# EAGLE design Servotor32 (EAGLE 6.2)
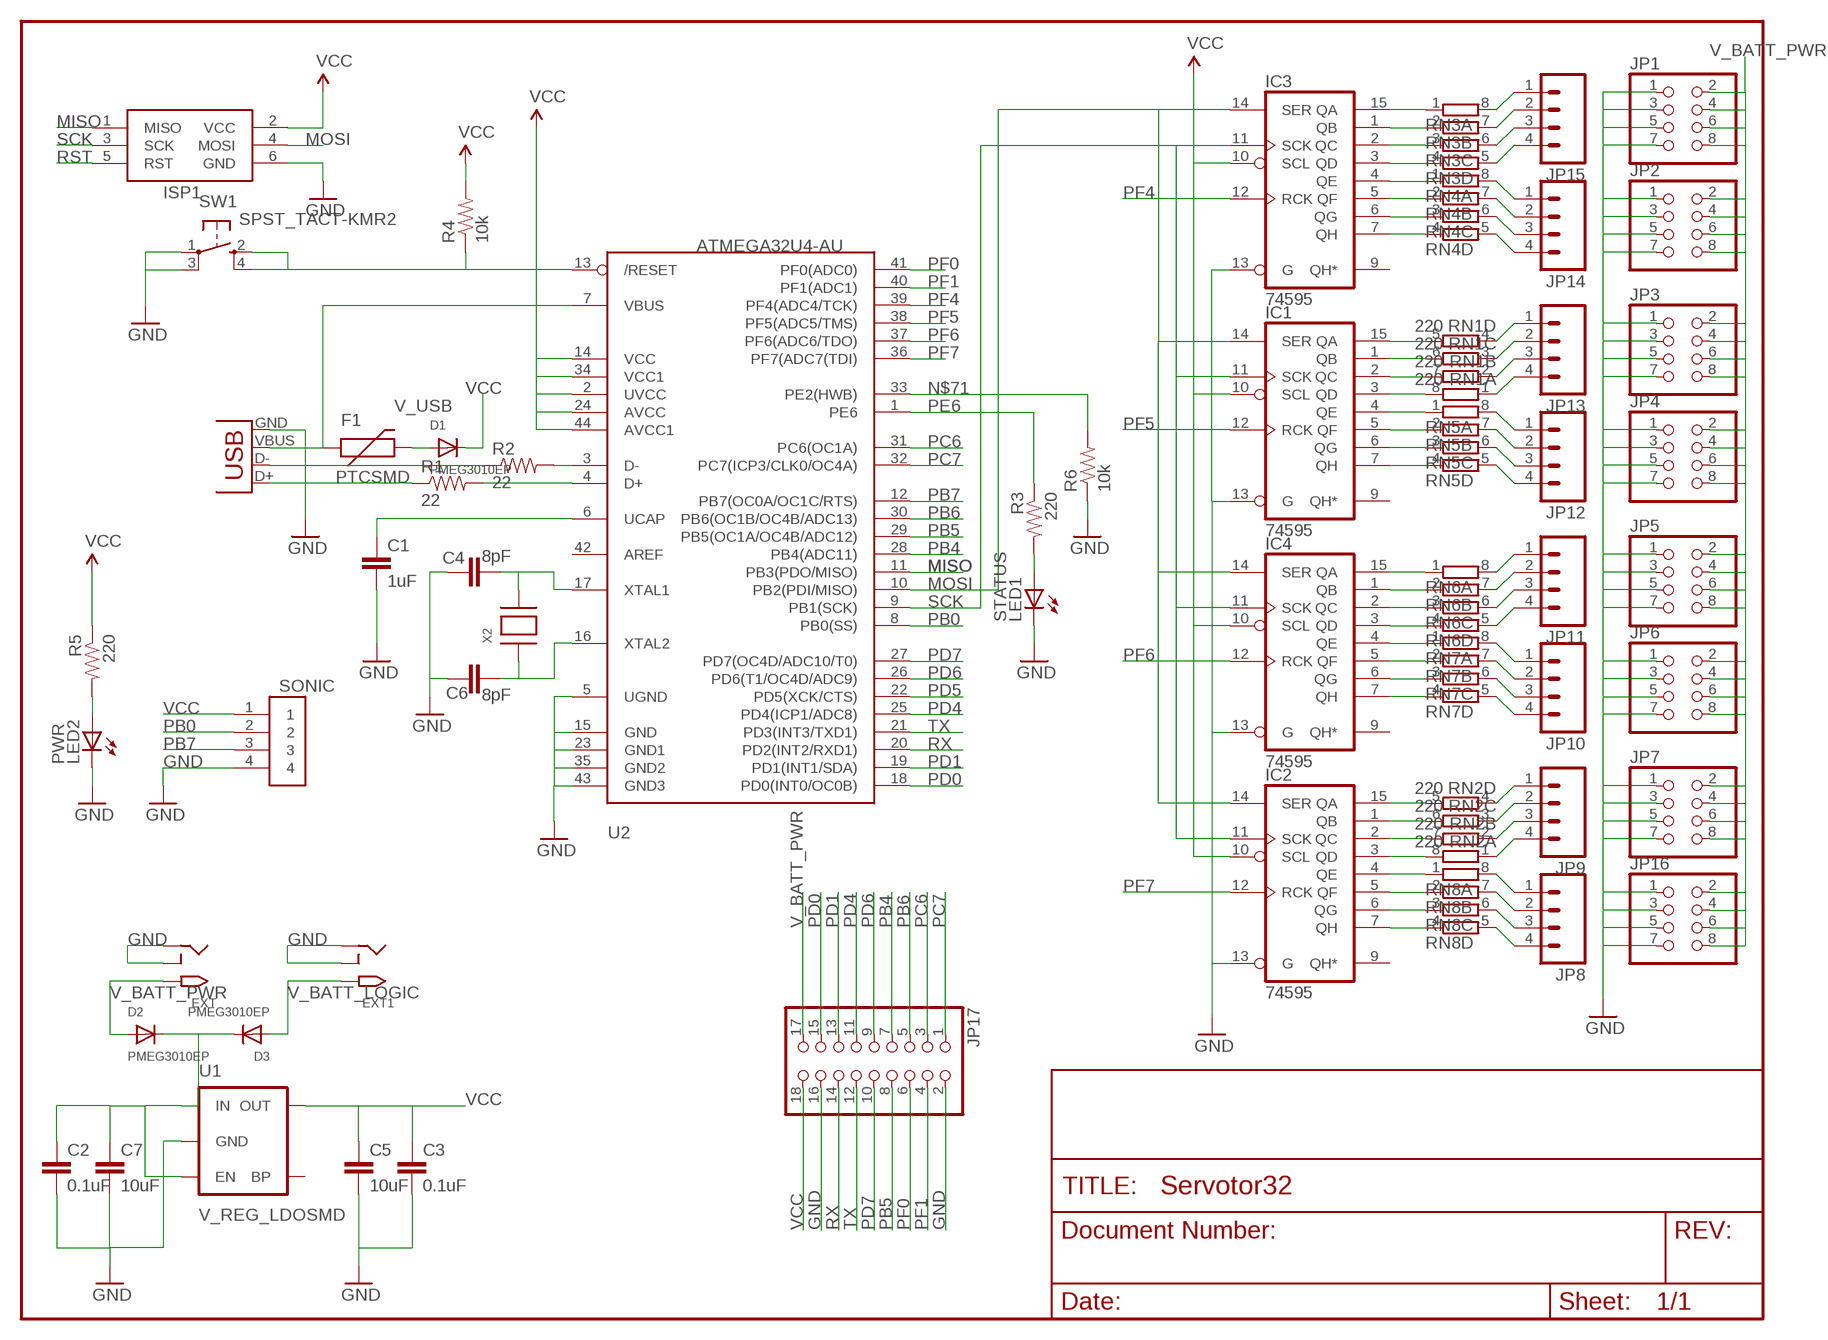
[diagram p0: schematic, sheet 1]

## Parts
C1  1uF  CAP0603-CAP  [0603-CAP]
C2  0.1uF  CAP0603-CAP  [0603-CAP]
C3  0.1uF  CAP0603-CAP  [0603-CAP]
C4  8pF  CAP0603-CAP  [0603-CAP]
C5  10uF  CAP0805  [0805]
C6  8pF  CAP0603-CAP  [0603-CAP]
C7  10uF  CAP0805  [0805]
D1  PMEG3010EP  [SOD-128]
D2  PMEG3010EP  [SOD-128]
D3  PMEG3010EP  [SOD-128]
EXT  2.1MMJACKTHM  [PJ-102A]
EXT1  2.1MMJACKTHM  [PJ-102A]
F1  PTCSMD  [PTC-1206]
IC1  74595  [TSSOP16]
IC2  74595  [TSSOP16]
IC3  74595  [TSSOP16]
IC4  74595  [TSSOP16]
ISP1  AVRISP-6  [AVRISP]
JP1  PINHD-2X4  [2X04]
JP2  PINHD-2X4  [2X04]
JP3  PINHD-2X4  [2X04]
JP4  PINHD-2X4  [2X04]
JP5  PINHD-2X4  [2X04]
JP6  PINHD-2X4  [2X04]
JP7  PINHD-2X4  [2X04]
JP8  M04PTH  [1X04]
JP9  M04PTH  [1X04]
JP10  M04PTH  [1X04]
JP11  M04PTH  [1X04]
JP12  M04PTH  [1X04]
JP13  M04PTH  [1X04]
JP14  M04PTH  [1X04]
JP15  M04PTH  [1X04]
JP16  PINHD-2X4  [2X04]
JP17  PINHD-2X9-BIG  [2X09-BIG]
LED1  STATUS  LEDSML0805  [SML0805]
LED2  PWR  LEDSML0805  [SML0805]
R1  22  RESISTOR0603-RES  [0603-RES]
R2  22  RESISTOR0603-RES  [0603-RES]
R3  220  RESISTOR0603-RES  [0603-RES]
R4  10k  RESISTOR0603-RES  [0603-RES]
R5  220  RESISTOR0603-RES  [0603-RES]
R6  10k  RESISTOR0603-RES  [0603-RES]
RN1  220  4R-NEXB38V  [EXB38V]
RN2  220  4R-NEXB38V  [EXB38V]
RN3  4R-NEXB38V  [EXB38V]
RN4  4R-NEXB38V  [EXB38V]
RN5  4R-NEXB38V  [EXB38V]
RN6  4R-NEXB38V  [EXB38V]
RN7  4R-NEXB38V  [EXB38V]
RN8  4R-NEXB38V  [EXB38V]
SONIC  SONIC  1X4-BIG  [1X04-BIG]
SW1  SPST_TACT-KMR2  [KMR2]
U1  V_REG_LDOSMD  [SOT23-5]
U2  ATMEGA32U4-AU  [TQFP44]
X1  USBSMD  [USB-MINIB]
X2  XTALNX5032  [NX5032]

## Nets
D+: R1.2 U2.4(D+)
D-: R2.2 U2.3(D-)
GND: C1.2 C2.2 C3.2 C4.2 C5.2 C6.2 C7.2 EXT1.RING EXT1.RING_SW EXT.RING EXT.RING_SW IC1.13(G) IC2.13(G) IC3.13(G) IC4.13(G) ISP1.6(GND) JP1.1 JP1.3 JP1.5 JP1.7 JP2.1 JP2.3 JP2.5 JP2.7 JP3.1 JP3.3 JP3.5 JP3.7 JP4.1 JP4.3 JP4.5 JP4.7 JP5.1 JP5.3 JP5.5 JP5.7 JP6.1 JP6.3 JP6.5 JP6.7 JP7.1 JP7.3 JP7.5 JP7.7 JP16.1 JP16.3 JP16.5 JP16.7 JP17.2 JP17.16 LED1.C LED2.C R6.1 SONIC.4 SW1.1(P) SW1.3(P1) U1.2(GND) U2.5(UGND) U2.15(GND) U2.23(GND1) U2.35(GND2) U2.43(GND3) X1.GND
MISO: ISP1.1(MISO) U2.11(PB3(PDO/MISO))
MOSI: IC1.14(SER) IC2.14(SER) IC3.14(SER) IC4.14(SER) ISP1.4(MOSI) U2.10(PB2(PDI/MISO))
N$1: IC3.15(QA) RN3.1
N$2: LED2.A R5.2
N$3: IC1.3(QD) RN1.8
N$4: R2.1 X1.D-
N$5: R1.1 X1.D+
N$6: IC2.3(QD) RN2.8
N$7: IC1.2(QC) RN1.7
N$8: IC2.2(QC) RN2.7
N$10: IC1.1(QB) RN1.6
N$11: IC3.1(QB) RN3.2
N$12: IC1.15(QA) RN1.5
N$13: IC3.2(QC) RN3.3
N$14: IC3.3(QD) RN3.4
N$15: IC2.1(QB) RN2.6
N$16: IC2.15(QA) RN2.5
N$17: IC3.4(QE) RN4.1
N$18: IC3.5(QF) RN4.2
N$19: IC3.6(QG) RN4.3
N$20: IC3.7(QH) RN4.4
N$21: IC1.4(QE) RN5.1
N$22: IC1.5(QF) RN5.2
N$23: JP13.1 RN1.4
N$24: IC1.6(QG) RN5.3
N$25: IC1.7(QH) RN5.4
N$26: JP12.1 RN5.8
N$27: JP13.2 RN1.3
N$28: JP13.3 RN1.2
N$29: JP13.4 RN1.1
N$30: JP12.2 RN5.7
N$31: JP12.3 RN5.6
N$32: JP12.4 RN5.5
N$33: JP15.1 RN3.8
N$34: JP15.2 RN3.7
N$35: JP15.3 RN3.6
N$36: JP15.4 RN3.5
N$37: JP14.1 RN4.8
N$38: JP14.2 RN4.7
N$39: JP14.3 RN4.6
N$40: JP14.4 RN4.5
N$41: JP9.4 RN2.1
N$42: JP9.3 RN2.2
N$43: JP9.2 RN2.3
N$44: JP9.1 RN2.4
N$45: IC2.4(QE) RN8.1
N$46: IC2.5(QF) RN8.2
N$47: IC2.6(QG) RN8.3
N$48: IC2.7(QH) RN8.4
N$49: JP8.1 RN8.8
N$50: JP8.2 RN8.7
N$51: JP8.3 RN8.6
N$52: JP8.4 RN8.5
N$54: IC4.1(QB) RN6.2
N$55: IC4.2(QC) RN6.3
N$56: IC4.3(QD) RN6.4
N$57: IC4.4(QE) RN7.1
N$58: IC4.5(QF) RN7.2
N$59: IC4.6(QG) RN7.3
N$60: IC4.7(QH) RN7.4
N$61: JP11.1 RN6.8
N$62: JP11.2 RN6.7
N$63: JP11.3 RN6.6
N$64: JP11.4 RN6.5
N$65: JP10.1 RN7.8
N$66: JP10.2 RN7.7
N$67: JP10.3 RN7.6
N$68: JP10.4 RN7.5
N$69: LED1.A R3.2
N$71: R6.2 U2.33(PE2(HWB))
N$73: IC4.15(QA) RN6.1
PB0: SONIC.2 U2.8(PB0(SS))
PB4: JP17.7 U2.28(PB4(ADC11))
PB5: JP17.8 U2.29(PB5(OC1A/OC4B/ADC12))
PB6: JP17.5 U2.30(PB6(OC1B/OC4B/ADC13))
PB7: SONIC.3 U2.12(PB7(OC0A/OC1C/RTS))
PC6: JP17.3 U2.31(PC6(OC1A))
PC7: JP17.1 U2.32(PC7(ICP3/CLK0/OC4A))
PD0: JP17.15 U2.18(PD0(INT0/OC0B))
PD1: JP17.13 U2.19(PD1(INT1/SDA))
PD4: JP17.11 U2.25(PD4(ICP1/ADC8))
PD5: U2.22(PD5(XCK/CTS))
PD6: JP17.9 U2.26(PD6(T1/OC4D/ADC9))
PD7: JP17.10 U2.27(PD7(OC4D/ADC10/T0))
PE6: R3.1 U2.1(PE6)
PF0: JP17.6 U2.41(PF0(ADC0))
PF1: JP17.4 U2.40(PF1(ADC1))
PF4: IC3.12(RCK) U2.39(PF4(ADC4/TCK))
PF5: IC1.12(RCK) U2.38(PF5(ADC5/TMS))
PF6: IC4.12(RCK) U2.37(PF6(ADC6/TDO))
PF7: IC2.12(RCK) U2.36(PF7(ADC7(TDI))
RST: ISP1.5(RST) R4.1 SW1.2(S) SW1.4(S1) U2.13(/RESET)
RX: JP17.14 U2.20(PD2(INT2/RXD1))
SCK: IC1.11(SCK) IC2.11(SCK) IC3.11(SCK) IC4.11(SCK) ISP1.3(SCK) U2.9(PB1(SCK))
TX: JP17.12 U2.21(PD3(INT3/TXD1))
UCAP: C1.1 U2.6(UCAP)
V_BATT: C2.1 C7.1 D2.P$1(C) D3.P$1(C) U1.1(IN) U1.3(EN)
V_BATT_LOGIC: D3.P$2(A) EXT1.TIP
V_BATT_PWR: D2.P$2(A) EXT.TIP JP1.2 JP1.4 JP1.6 JP1.8 JP2.2 JP2.4 JP2.6 JP2.8 JP3.2 JP3.4 JP3.6 JP3.8 JP4.2 JP4.4 JP4.6 JP4.8 JP5.2 JP5.4 JP5.6 JP5.8 JP6.2 JP6.4 JP6.6 JP6.8 JP7.2 JP7.4 JP7.6 JP7.8 JP16.2 JP16.4 JP16.6 JP16.8 JP17.17
V_USB: D1.P$2(A) F1.2
VBUS: F1.1 U2.7(VBUS) X1.VBUS
VCC: C3.1 C5.1 D1.P$1(C) IC1.10(SCL) IC2.10(SCL) IC3.10(SCL) IC4.10(SCL) ISP1.2(VCC) JP17.18 R4.2 R5.1 SONIC.1 U1.5(OUT) U2.2(UVCC) U2.14(VCC) U2.24(AVCC) U2.34(VCC1) U2.44(AVCC1)
XTAL1: C4.1 U2.17(XTAL1) X2.P$2
XTAL2: C6.1 U2.16(XTAL2) X2.P$1
Unconnected: IC1.9(QH*) IC2.9(QH*) IC3.9(QH*) IC4.9(QH*) U1.4(BP) U2.42(AREF)

## Power pins joined to a net without a drawn wire
GND: IC1.8(GND) IC2.8(GND) IC3.8(GND) IC4.8(GND)
VCC: IC1.16(VCC) IC2.16(VCC) IC3.16(VCC) IC4.16(VCC)

## Library data of the parts
C1-C7 = SparkFun-Passives:CAP: Capacitor Standard 0603 ceramic capacitor, and 0.1" leaded capacitor.
D1-D3 = arcbotics:PMEG3010EP
EXT EXT1 = adafruit:2.1MMJACK: 2.1mm x 5.5mm THM DC jack with internal switch. Digikey part #PJ-102A, 4UCON part #05537 2.1mm x 5.5mm SMT DC jack with internal switch. Digikey part #PJ-002A-SMT, 4UCON part #03267 By microbuilder.eu & adafruit.com
F1 = SparkFun:PTC: Resettable Fuse PTC Resettable Fuse. Spark Fun Electronics SKU : COM-08357
IC1-IC4 = arcbotics:74*595: 8-bit SHIFT REGISTER, output latch
ISP1 = adafruit:AVRISP: AVR ISP HEADER Standard 6 pin header for AVR programming
JP1-JP7 JP16 = pinhead-nosilk:PINHD-2X4: PIN HEADER
JP8-JP15 = pinhead-nosilk:M04: Header 4 Standard 4-pin 0.1" header. Use with straight break away headers (SKU : PRT-00116), right angle break away headers (PRT-00553), swiss pins (PRT-00743), machine pins (PRT-00117), and female headers (PRT-00115). Molex polarized connector foot print use with SKU : PRT-08231 with associated crimp pins and housings. 1MM SMD Version SKU: PRT-10208
JP17 = adafruit:PINHD-2X9: PIN HEADER With larger annulars
LED1 LED2 = led:LED: LED OSRAM: - CHIPLED LG R971, LG N971, LY N971, LG Q971, LY Q971, LO R971, LY R971 LH N974, LH R974 LS Q976, LO Q976, LY Q976 LO Q996 - Hyper CHIPLED LW Q18S LB Q993, LB Q99A, LB R99A - SideLED LS A670, LO A670, LY A670, LG A670, LP A670 LB A673, LV A673, LT A673, LW A673 LH A674 LY A675 LS A676, LA A676, LO A676, LY A676, LW A676 LS A679, LY A679, LG A679 - Hyper Micro SIDELED® LS Y876, LA Y876, LO Y876, LY Y876 LT Y87S - SmartLED LW L88C, LW L88S LB L89C, LB L89S, LG L890 LS L89K, LO L89K, LY L89K LS L896, LA L896, LO L896, LY L896 - TOPLED LS T670, LO T670, LY T670, LG T670, LP T670 LSG T670, LSP T670, LSY T670, LOP T670, LYG T670 LG T671, LOG T671, LSG T671 LB T673, LV T673, LT T673, LW T673 LH T674 LS T676, LA T676, LO T676, LY T676, LB T676, LH T676, LSB T676, LW T676 LB T67C, LV T67C, LT T67C, LS T67K, LO T67K, LY T67K, LW E67C LS E67B, LA E67B, LO E67B, LY E67B, LB E67C, LV E67C, LT E67C LW T67C LS T679, LY T679, LG T679 LS T770, LO T770, LY T770, LG T770, LP T770 LB T773, LV T773, LT T773, LW T773 LH T774 LS E675, LA E675, LY E675, LS T675 LS T776, LA T776, LO T776, LY T776, LB T776 LHGB T686 LT T68C, LB T68C - Hyper Mini TOPLED® LB M676 - Mini TOPLED Santana® LG M470 LS M47K, LO M47K, LY M47K Source: http://www.osram.convergy.de LUXEON: - LUMILED® LXK2-PW12-R00, LXK2-PW12-S00, LXK2-PW14-U00, LXK2-PW14-V00 LXK2-PM12-R00, LXK2-PM12-S00, LXK2-PM14-U00 LXK2-PE12-Q00, LXK2-PE12-R00, LXK2-PE12-S00, LXK2-PE14-T00, LXK2-PE14-U00 LXK2-PB12-K00, LXK2-PB12-L00, LXK2-PB12-M00, LXK2-PB14-N00, LXK2-PB14-P00, LXK2-PB14-Q00 LXK2-PR12-L00, LXK2-PR12-M00, LXK2-PR14-Q00, LXK2-PR14-R00 LXK2-PD12-Q00, LXK2-PD12-R00, LXK2-PD12-S00 LXK2-PH12-R00, LXK2-PH12-S00 LXK2-PL12-P00, LXK2-PL12-Q00, LXK2-PL12-R00 Source: www.luxeon.com KINGBRIGHT: KA-3528ASYC Source: www.kingbright.com
R1-R6 = SparkFun-Passives:RESISTOR: Resistor Basic schematic elements and footprints for 0603, 1206, and PTH resistors.
RN1-RN8 = resistor-dil:4R-N: Array Chip Resistor Source: RS Component / Phycomp; OC_FARNELL: unknown; OC_NEWARK: unknown
SONIC = adafruit:1X4: 4-pin connector
SW1 = adafruit:SPST_TACT: SMT 6mm switch, EVQQ2 series http://www.ladyada.net/library/eagle
U1 = SparkFun:V_REG_LDO: Voltage Regulator LDO Standard 150mA LDO voltage regulator in SOT-23 layout. Micrel part MIC5205. BP (by-pass) pin is used to lower output noise with 470pF cap.
U2 = adafruit:ATMEGA32U4: http://www.ladyada.net/library/eagle
X1 = SparkFun:USB: USB Connectors USB-B-PTH is fully proven SKU : PRT-00139 USB-miniB is fully proven SKU : PRT-00587 USB-A-PCB is untested. USB-A-H is throughly reviewed, but untested. Spark Fun Electronics SKU : PRT-00437 USB-B-SMT is throughly reviewed, but untested. Needs silkscreen touching up. USB-A-S has not been used/tested USB-MB-H has not been used/tested
X2 = adafruit:XTAL: Low cost SMT crystals, no capacitors included http://www.ladyada.net/library/eagle

## Board
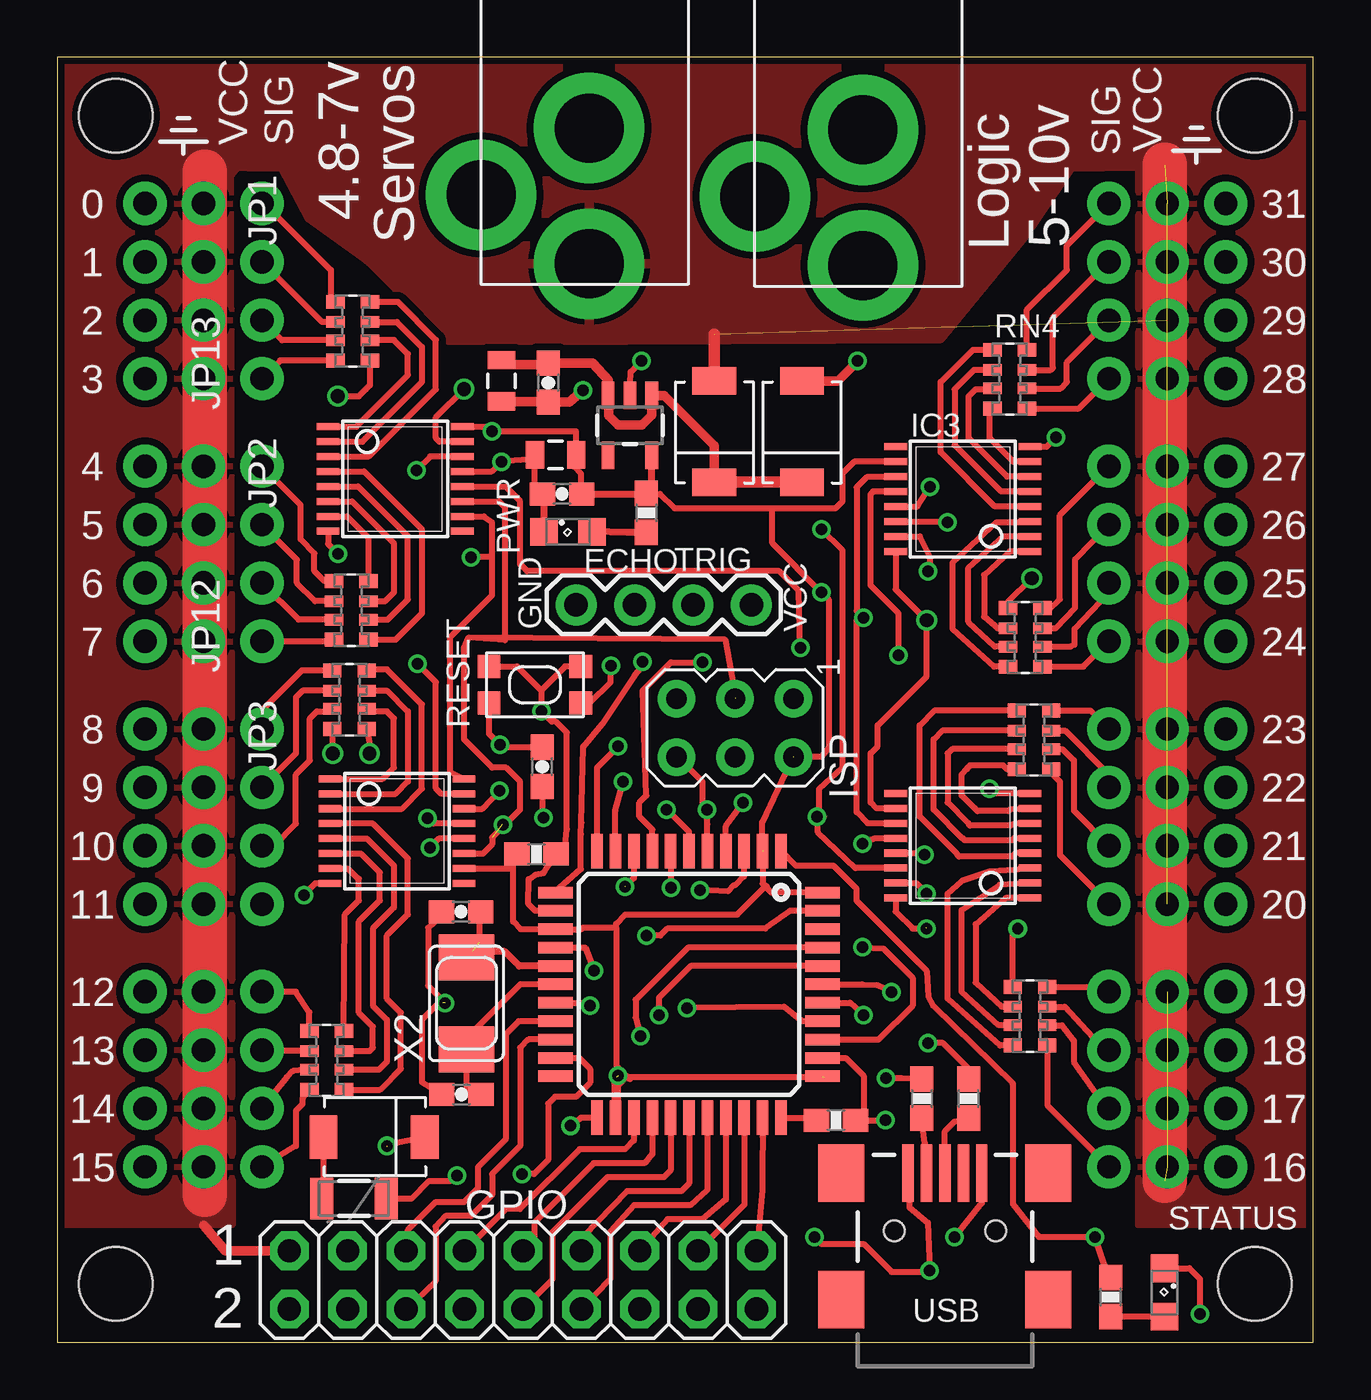
[diagram p1: board, top side]
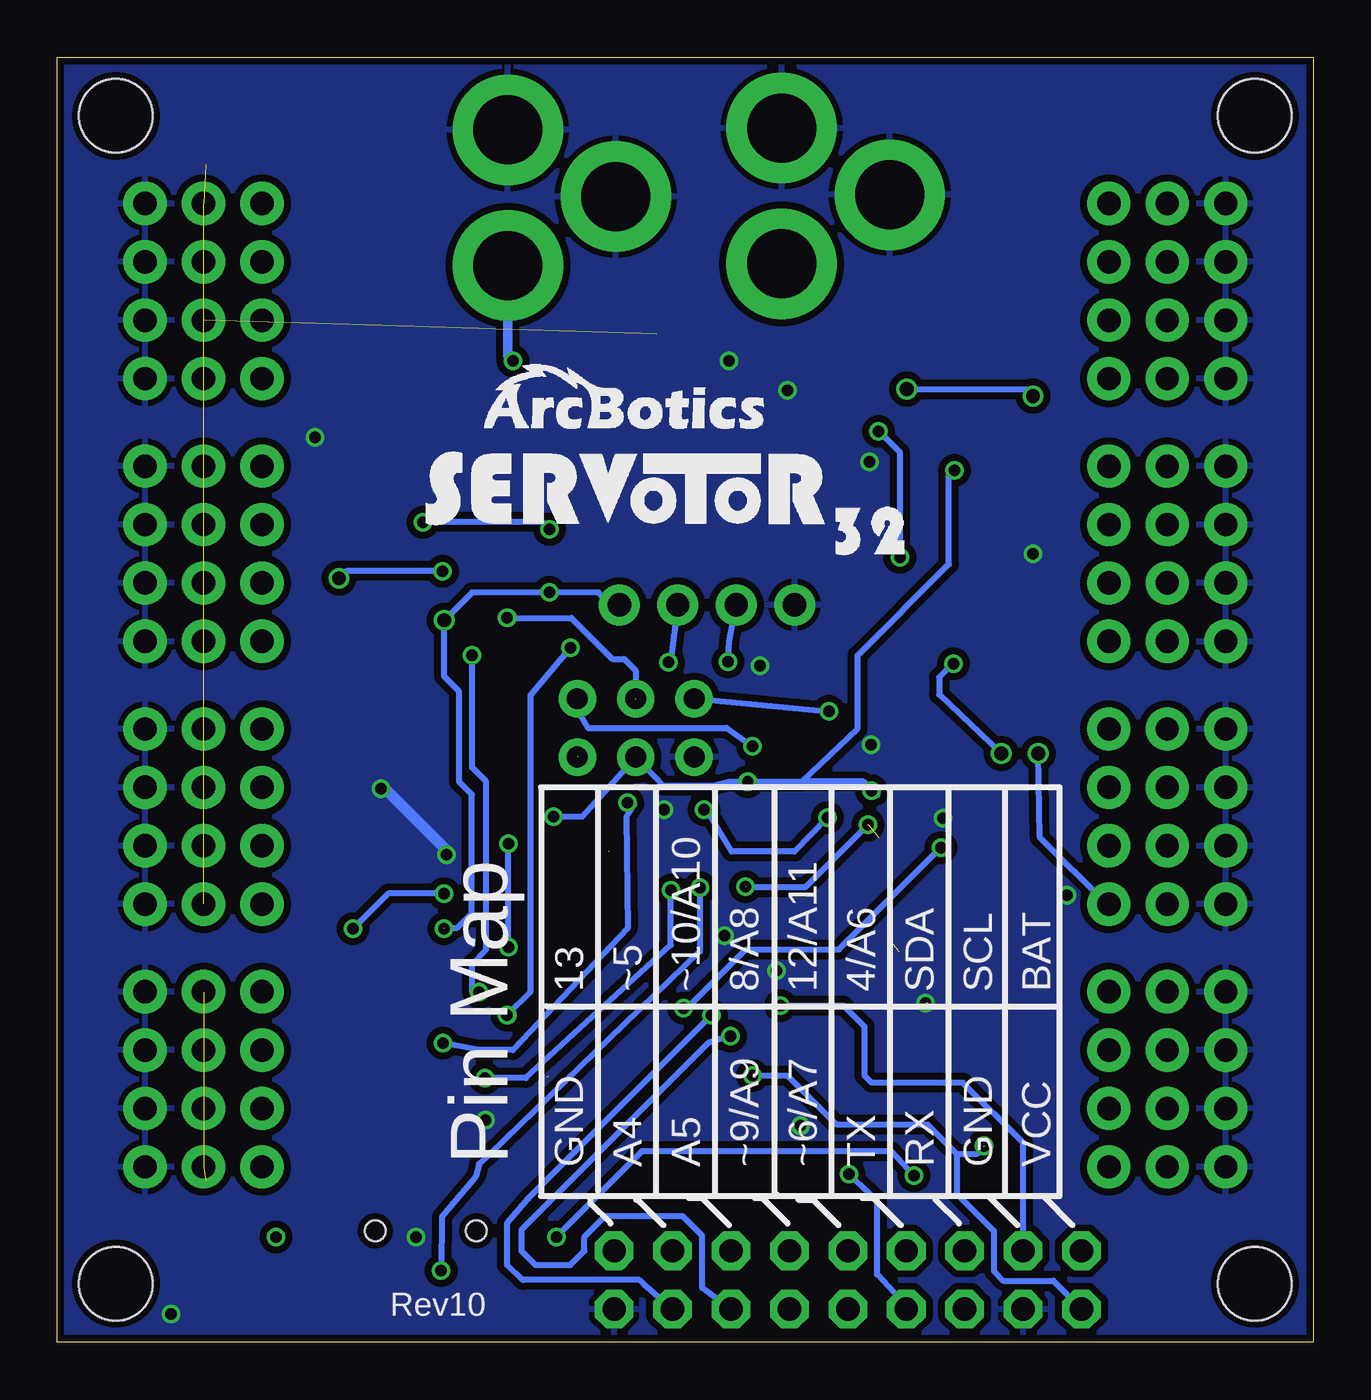
[diagram p2: board, bottom side, seen from below]

Size 54.61 x 55.88 mm. Coordinates in mm from the lower left corner, seen from the top.
Outline: 0,0 54.61,0 54.61,55.88 0,55.88 0,0
Copper layers (1*16): Top 0.035mm / dielectric 1.5mm / Bottom 0.035mm
Design rules: minimum track width 6mil, minimum drill 12mil, track to track 6mil, track to pad 6mil, pad to pad 6mil, via to via 6mil, smd to smd 0mil, copper to edge 10mil, drill to drill 10mil, minimum pad ring 10mil, minimum via ring 6mil, stop-mask expansion 2mil, vias tented up to drill 100mil, thermal gap 10mil
Holes 3.2 mm at 2.54,53.34 2.54,2.54 52.07,53.34 52.07,2.54

### Footprints (pad centres in the part's own frame; a part is rotated, then mirrored left to right if it is on the bottom)
0603-CAP = smd 1.1 x 1: 1 -0.85,0; 2 0.85,0
0805 = smd 0.8 x 1.2: 1 -0.9,0; 2 0.9,0
SOD-128 = smd 1.2 x 1.9: P$1 -2.223,0.016; P$2 2.179,0.016
PJ-102A = drill 3 pad 4.8: RING 0.1,-3.39; RING_SW -4.6,-6.29; TIP 0.1,-9.29
PTC-1206 = smd 1 x 1.8: 1 -1.4,0; 2 1.4,0
TSSOP16 = smd 0.305 x 0.991: 1 -2.275,-2.918; 2 -1.625,-2.918; 3 -0.975,-2.918; 4 -0.325,-2.918; 5 0.325,-2.918; 6 0.975,-2.918; 7 1.625,-2.918; 8 2.275,-2.918; 9 2.275,2.918; 10 1.625,2.918; 11 0.975,2.918; 12 0.325,2.918; 13 -0.325,2.918; 14 -0.975,2.918; 15 -1.625,2.918; 16 -2.275,2.918
AVRISP = drill 0.9 pad 1.626: 1 -1.27,2.54; 2 1.27,2.54; 3 -1.27,0; 4 1.27,0; 5 -1.27,-2.54; 6 1.27,-2.54
2X04 = drill 1.016 pad 1.88: 1 -3.81,-1.27; 2 -3.81,1.27; 3 -1.27,-1.27; 4 -1.27,1.27; 5 1.27,-1.27; 6 1.27,1.27; 7 3.81,-1.27; 8 3.81,1.27
1X04 = drill 1.016 pad 1.88: 1 0,0; 2 2.54,0; 3 5.08,0; 4 7.62,0
2X09-BIG = drill 1.016 pad 1.676 octagon: 1 -10.16,-1.27; 2 -10.16,1.27; 3 -7.62,-1.27; 4 -7.62,1.27; 5 -5.08,-1.27; 6 -5.08,1.27; 7 -2.54,-1.27; 8 -2.54,1.27; 9 0,-1.27; 10 0,1.27; 11 2.54,-1.27; 12 2.54,1.27; 13 5.08,-1.27; 14 5.08,1.27; 15 7.62,-1.27; 16 7.62,1.27; 17 10.16,-1.27; 18 10.16,1.27
SML0805 = smd 1.2 x 1.2: A 1.05,0; C -1.05,0
0603-RES = smd 1.1 x 1: 1 -0.85,0; 2 0.85,0
EXB38V = smd 0.6 x 0.8: 1 -1.275,-0.75; 4 1.275,-0.75; 5 1.275,0.75; 8 -1.275,0.75 | smd 0.5 x 0.8: 2 -0.4,-0.75; 3 0.4,-0.75; 6 0.4,0.75; 7 -0.4,0.75
1X04-BIG = drill 1.016 pad 1.778: 1 0,0; 2 2.54,0; 3 5.08,0; 4 7.62,0
KMR2 = smd 1 x 1: 1 2,0.8; 2 2,-0.8; 3 -2,0.8; 4 -2,-0.8
SOT23-5 = smd 0.55 x 1.2: 1 -0.95,-1.3; 2 0,-1.3; 3 0.95,-1.3; 4 0.95,1.3; 5 -0.95,1.3
TQFP44 = smd 1.5 x 0.5: 1 -5.8,4; 2 -5.8,3.2; 3 -5.8,2.4; 4 -5.8,1.6; 5 -5.8,0.8; 6 -5.8,0; 7 -5.8,-0.8; 8 -5.8,-1.6; 9 -5.8,-2.4; 10 -5.8,-3.2; 11 -5.8,-4; 23 5.8,-4; 24 5.8,-3.2; 25 5.8,-2.4; 26 5.8,-1.6; 27 5.8,-0.8; 28 5.8,0; 29 5.8,0.8; 30 5.8,1.6; 31 5.8,2.4; 32 5.8,3.2; 33 5.8,4 | smd 0.5 x 1.5: 12 -4,-5.8; 13 -3.2,-5.8; 14 -2.4,-5.8; 15 -1.6,-5.8; 16 -0.8,-5.8; 17 0,-5.8; 18 0.8,-5.8; 19 1.6,-5.8; 20 2.4,-5.8; 21 3.2,-5.8; 22 4,-5.8; 34 4,5.8; 35 3.2,5.8; 36 2.4,5.8; 37 1.6,5.8; 38 0.8,5.8; 39 0,5.8; 40 -0.8,5.8; 41 -1.6,5.8; 42 -2.4,5.8; 43 -3.2,5.8; 44 -4,5.8
USB-MINIB = smd 2.5 x 0.5: D+ 2.5,0; D- 2.5,0.8; GND 2.5,-1.6; ID 2.5,-0.8; VBUS 2.5,1.6 | smd 2.5 x 2: MTN1 -3,4.5; MTN2 2.5,4.5; MTN3 -3,-4.5; MTN4 2.5,-4.5 | hole 0.9: 0,2.2; 0,-2.2
NX5032 = smd 2 x 2.4: P$1 2,0; P$2 -2,0

### Placement (x,y rotation side)
C1  21.08,25.02 90 top
C2  21.34,41.74 270 top
C3  21.95,36.9 180 top
C4  17.56,10.78 180 top
C5  21.66,38.6 180 top
C6  17.55,18.72 180 top
C7  19.3,41.81 270 top
D1  13.75,8.93 180 top
D2  28.57,39.62 90 top
D3  32.38,39.62 90 top
EXT  23.02,56.2 0 top
EXT1  34.92,56.12 0 top
F1  12.89,6.24 180 top
IC1  14.68,37.54 270 top
IC2  39.37,21.59 90 top
IC3  39.37,36.67 90 top
IC4  14.76,22.23 270 top
ISP1  29.46,26.72 270 top
JP1  5.08,45.72 270 top
JP2  5.08,34.29 270 top
JP3  5.08,22.86 270 top
JP4  5.08,11.43 270 top
JP5  49.53,45.72 90 top
JP6  49.53,34.29 90 top
JP7  49.53,22.86 90 top
JP8  45.72,26.67 270 top
JP9  45.72,15.24 270 top
JP10  8.89,7.62 90 top
JP11  8.89,19.05 90 top
JP12  8.89,30.48 90 top
JP13  8.89,41.91 90 top
JP14  45.72,49.53 270 top
JP15  45.72,38.1 270 top
JP16  49.53,11.43 90 top
JP17  20.24,2.7 180 top
LED1  48.13,2.16 270 top
LED2  22.2,35.25 0 top
R1  39.62,10.59 90 top
R2  37.59,10.59 90 top
R3  45.8,1.96 270 top
R4  20.83,21.22 180 top
R5  25.6,36.07 270 top
R6  33.86,9.65 180 top
RN1  12.83,43.97 270 top
RN2  42.29,14.18 90 top
RN3  42.08,30.65 270 top
RN4  41.41,41.88 270 top
RN5  12.78,31.83 90 top
RN6  12.7,27.94 90 top
RN7  11.71,12.26 90 top
RN8  42.47,26.19 270 top
SONIC  30.18,32.07 180 top
SW1  20.76,28.59 180 top
U1  24.89,39.88 180 top
U2  27.46,15.56 270 top
X1  38.59,4.84 90 top
X2  17.78,14.73 90 top

### Tracks (layer width: path | path; a pad name or v marks a point on that pad's centre or on a via)
D+  (via drill 0.5)
  Top 0.254: U2.4 29.06,22.45 v29.82,23.47 | R1.2 39.62,11.89 38.51,13.01 v37.85,13.01
  Bottom 0.254: v29.82,23.47 29.52,23.42 29.87,22.86 29.82,17.98 34.8,12.7 36.32,12.7 v37.85,13.01
D-  (via drill 0.5)
  Top 0.254: U2.3 29.84,21.34 29.84,20.24 29.46,19.86 29.41,19.86 29.16,19.61 v27.94,19.66 | v36.02,11.48 36.32,11.48 36.71,11.49 R2.2
  Bottom 0.254: v36.02,11.48 34.24,11.48 27.94,17.27 v27.94,19.66
GND  (via drill 0.5)  (1 unrouted)
  Top 0.254: U2.5 28.26,22.54 v28.25,23.16 28.04,22.96 28.04,24.38 26.98,25.45 ISP1.6 | U2.23 22.77,9.76 v22.3,9.4 | U2.15 22.94,17.16 v23.34,16.15 | IC3.8 43.01,38.95 v43.42,39.35 | IC3.13 37.39,36.35 v37.94,37.2 | IC4.8 11.22,19.95 v10.72,19.45 | 20.53,38.51 C5.2 | IC2.13 37.63,21.27 v37.7,21.19 | C5.2 20.76,38.44 20.73,38.41 v19.3,38.29 18.88,37.87 IC1.13 | U1.2 24.92,42.2 v25.4,42.67 | C3.2 20.76,36.86 C5.2 | IC1.8 11.77,34.72 v12.19,34.29 | v36,9.65 R6.1 35.05,10 35.05,11.58 34.28,12.36 U2.35 | IC4.13 16.34,22.55 v16.1,22.8 | SW1.3 23.15,27.79 24.05,28.69 v24.06,29.43 | C6.2 16.89,18.72 16.11,18.02 16.11,15.49 16.74,14.86 16.74,14.75 16.58,14.75 15.85,14.02 15.85,11.31 C4.2 | X1.GND 40.19,6.05 v39.01,4.57 | 47.69,3.21 LED1.C 49.22,3.21 49.68,2.74 v49.68,1.22 | U2.43 31.86,18.76 30.79,17.98 26.52,17.98 26.21,17.68 v25.6,17.68 | IC2.8 40.75,23.86 v40.54,24.08 | C1.2 19.36,25.87 v19.24,25.99 18.77,26.46 SW1.1
  Top 0.305: C3.2 21.15,36.29 LED2.C
  Top 0.406: C7.2 21.29,40.91 C2.2 22.26,40.88 v22.86,41.4
  Bottom 0.254: v37.7,21.19 37.7,21.24 v40.54,24.08 40.23,24.08 37.49,21.34
  other vias: 16.86,14.75
  pour Bottom (isolate 0.305): -1.11,58.34 55.88,58.42 55.88,-1.27 -1.27,-1.27
MISO  (via drill 0.5)
  Top 0.254: U2.11 23.46,24.99 v24.38,25.91
  Bottom 0.254: ISP1.1 31.91,27.3 31.54,26.72 25.51,26.72 v24.38,25.91
MOSI  (via drill 0.5)
  Top 0.254: U2.10 24.26,23.12 v24.59,24.38 | 33.33,22.86 33.06,22.86 | 33.06,22.86 v33.04,22.86 33.12,23.04 33.12,24.05 34.14,24.99 34.14,34.44 v33.22,35.36 | IC4.14 18.47,23.2 v19.21,23.97 | IC1.14 16.2,38.52 v15.61,37.92 | IC3.14 38.67,35.7 v38.71,35.66 | IC2.14 34.7,20.61 33.06,22.17 33.06,22.86
  Bottom 0.254: 22.23,24.38 v24.59,24.38 25.4,24.37 26.1,24.2 28.26,24.2 ISP1.4 31.8,22.86 v33.04,22.86 | 22.23,24.38 19.81,26.67 19.81,29.87 15.85,33.83 15.85,37.69 v15.61,37.92 | v19.21,23.97 18.95,23.78 19.56,24.38 22.23,24.38 | v33.22,35.36 33.53,35.66 v38.71,35.66
N$1  (via drill 0.5, 0.6)
  Top 0.254: IC3.15 37.5,35.05 37.93,34.14 37.93,33.58 v37.86,33.53 | RN3.1 41.33,32.19 v42.37,33.22
  Bottom 0.254: v37.86,33.53 42.06,33.53 v42.37,33.22
N$2
  Top 0.305: R5.2 24.77,35.22 LED2.A
N$3
  Top 0.254: IC1.3 13.53,38.52 16.46,41.45 16.46,43.59 14.8,45.25 RN1.8
N$4
  Top 0.254: X1.D- 37.72,8.65 37.61,9.54 37.62,9.7 R2.1
N$5
  Top 0.254: X1.D+ 38.59,9.17 39.01,9.6 R1.1
N$6
  Top 0.254: IC2.3 41.65,20.54 40.56,20.48 39.35,20.06 38.71,19.49 38.71,14.94 40.98,12.9 RN2.8
N$7
  Top 0.254: RN1.7 14.76,44.37 15.85,43.28 15.85,41.76 13.26,39.17 IC1.2
N$8
  Top 0.254: IC2.2 40.97,19.89 39.32,18.79 39.32,15.24 40.94,13.78 RN2.7
N$9  (via drill 0.5)
  other vias: 37.8,17.98
N$10
  Top 0.254: IC1.1 13,39.82 15.24,42.06 15.24,42.98 14.63,43.59 13.6,43.59 RN1.6
N$11
  Top 0.254: IC3.1 41.41,34.4 40.3,33.37 40.3,31.55 40.88,31.05 RN3.2
N$12  (via drill 0.6)
  Top 0.254: IC1.15 16.61,39.17 16.46,39.32 16.46,40.23 v17.68,41.45 | RN1.5 13.58,41.62 13.41,41.45 13.11,41.15 v12.19,41.15
  Bottom 0.254: v17.68,41.45 12.5,41.45 v12.19,41.15
N$13
  Top 0.254: RN3.3 40.77,30.25 39.61,31.33 39.61,33.67 41.15,35.05 IC3.2
N$14
  Top 0.254: RN3.4 40.73,29.38 38.92,31.02 38.92,33.9 40.84,35.66 42.25,35.66 IC3.3
N$15
  Top 0.254: IC2.1 41.23,19.32 39.93,18.17 39.93,15.62 41.05,14.58 RN2.6
N$16  (via drill 0.5)
  Top 0.254: IC2.15 37.34,19.96 v37.8,19.51 | RN2.5 41.54,17.77 v41.76,17.98
  Bottom 0.254: v37.8,19.51 40.23,19.51 v41.76,17.98
N$17
  Top 0.254: IC3.4 40.77,36.35 38.41,38.71 38.41,41.76 39.81,43.16 RN4.1
N$18
  Top 0.254: IC3.5 41.03,37 39.01,39.01 39.01,41.45 39.85,42.28 RN4.2
N$19
  Top 0.254: IC3.6 41.3,37.65 39.62,39.32 39.62,41.15 39.93,41.45 40.63,41.45 RN4.3
N$20
  Top 0.254: IC3.7 41.56,38.3 40.54,39.32 40.54,40.42 RN4.4
N$21
  Top 0.254: IC1.4 13.34,37.87 15.85,35.36 15.85,31.7 14.71,30.55 RN5.1
N$22
  Top 0.254: RN5.2 14.36,31.43 15.24,32.31 15.24,35.05 13.07,37.22 IC1.5
N$23
  Top 0.254: RN1.4 9.68,42.7 JP13.1
N$24
  Top 0.254: IC1.6 12.81,36.57 14.63,34.75 14.63,32.61 14.25,32.23 RN5.3
N$25
  Top 0.254: IC1.7 12.6,35.92 13.53,34.98 RN5.4
N$26
  Top 0.254: RN5.8 11.96,30.48 JP12.1
N$27
  Top 0.254: RN1.3 9.77,43.57 JP13.2
N$28
  Top 0.254: RN1.2 11.51,44.37 JP13.3
N$29
  Top 0.254: JP13.4 8.99,49.53 11.89,46.63 11.89,45.45 RN1.1
N$30
  Top 0.254: RN5.7 10.48,31.43 JP12.2
N$31
  Top 0.254: RN5.6 11.21,32.23 10.41,33.02 10.41,34.04 JP12.3
N$32
  Top 0.254: JP12.4 10.57,36.42 10.57,34.91 11.18,34.31 11.18,33.53 11.6,33.1 RN5.5
N$33
  Top 0.254: RN3.8 43.14,31.86 43.59,32.31 43.59,35.97 JP15.1
N$34
  Top 0.254: RN3.7 43.4,31.05 44.25,31.94 44.25,34.05 JP15.2
N$35
  Top 0.254: RN3.6 44.05,30.25 44.23,30.34 44.23,31.03 45.72,32.61 JP15.3
N$36
  Top 0.254: RN3.5 44.62,29.38 JP15.4
N$37
  Top 0.254: RN4.8 42.16,44.9 43.89,46.63 43.89,47.7 JP14.1
N$38
  Top 0.254: RN4.7 43.2,42.28 43.28,42.37 43.28,44.55 JP14.2
N$39
  Top 0.254: RN4.6 43.62,41.48 43.89,41.76 43.89,42.62 JP14.3
N$40
  Top 0.254: RN4.5 44.42,40.61 JP14.4
N$41
  Top 0.254: JP9.4 43.04,10.3 RN2.1
N$42
  Top 0.254: JP9.3 45.62,10.16 44.2,12.19 44.2,13.11 43.68,13.78 RN2.2
N$43
  Top 0.254: JP9.2 45.52,12.7 43.8,14.58 RN2.3
N$44
  Top 0.254: RN2.4 45.25,15.46 JP9.1
N$45
  Top 0.254: IC2.4 41.66,21.27 41.51,21.11 39.21,21.11 39.13,21.19 39.09,21.27 37.49,22.86 37.49,26.82 38.14,27.47 RN8.1
N$46
  Top 0.254: IC2.5 41.6,21.91 41.51,21.83 39.45,21.83 39.37,21.91 39.35,21.91 38.1,23.16 38.1,26.21 38.48,26.59 RN8.2
N$47
  Top 0.254: IC2.6 41.69,22.57 41.43,22.46 39.69,22.46 39.61,22.54 39.61,22.57 38.71,23.47 38.71,25.6 38.9,25.79 RN8.3
N$48
  Top 0.254: IC2.7 41.43,23.18 41.35,23.1 40.01,23.1 39.89,23.21 39.88,23.21 39.32,23.77 39.32,24.69 39.55,24.92 39.53,24.92 39.69,25.08 41.12,25.08 41.28,24.92 RN8.4
N$49
  Top 0.254: RN8.8 44.92,27.47 JP8.1
N$50
  Top 0.254: RN8.7 43.81,26.59 45.72,24.69 JP8.2
N$51
  Top 0.254: RN8.6 43.7,25.79 44.2,25.3 44.2,23.11 JP8.3
N$52
  Top 0.254: RN8.5 43.22,24.75 43.59,24.38 43.59,21.18 JP8.4
N$53  (via drill 0.5)
  other vias: 45.11,4.57
N$54
  Top 0.254: IC4.1 14.14,24.5 14.63,24.99 14.63,27.13 14.33,27.43 13.56,27.43 RN6.2
N$55
  Top 0.254: RN6.3 14.33,28.34 15.24,27.43 15.24,24.38 14.71,23.85 IC4.2
N$56
  Top 0.254: IC4.3 14.97,23.2 15.85,24.08 15.85,27.74 14.33,29.26 13.5,29.26 RN6.4
N$57
  Top 0.254: RN7.1 14.03,10.98 14.94,11.89 | 14.63,11.58 14.94,11.89 | 14.94,11.89 14.94,14.33 14.33,14.94 14.33,17.68 15.24,18.59 15.24,21.03 13.72,22.55 IC4.4
N$58
  Top 0.254: IC4.5 13.46,21.9 14.63,20.73 14.63,18.9 13.72,17.98 13.72,14.63 14.33,14.02 14.33,12.19 13.99,11.86 RN7.2
N$59
  Top 0.254: RN7.3 13.57,12.65 13.72,12.8 13.72,13.72 13.11,14.33 13.11,18.29 14.02,19.2 14.02,20.42 13.19,21.25 IC4.6
N$60
  Top 0.254: RN7.4 12.5,18.59 13.11,19.2 13.11,20.16 13.07,20.16 12.62,20.6 IC4.7
N$61  (via drill 0.6)
  Top 0.254: RN6.8 11.95,25.84 v11.97,25.6
  Bottom 0.254: JP11.1 8.99,19.05 11.89,21.95 v11.97,25.6
N$62
  Top 0.254: JP11.2 9.4,21.59 10.36,22.55 10.36,24.69 10.97,25.3 10.97,27.13 11.28,27.43 11.84,27.43 RN6.7
N$63
  Top 0.254: RN6.6 10.66,28.34 10.36,28.04 10.36,25.6 JP11.3
N$64
  Top 0.254: JP11.4 8.89,27.48 10.62,29.21 RN6.5
N$65
  Top 0.254: RN7.8 10.65,10.6 10.65,10.35 10.36,10.06 10.36,8.53 JP10.1
N$66
  Top 0.254: RN7.7 10.23,11.79 9.96,11.52 JP10.2
N$67
  Top 0.254: RN7.6 8.93,12.65 JP10.3
N$68
  Top 0.254: RN7.5 10.96,14.34 10.36,15.24 JP10.4
N$69
  Top 0.254: LED1.A R3.2
N$71
  Top 0.254: U2.33 33.21,9.76 R6.2
N$73  (via drill 0.5, 0.6)
  Top 0.254: IC4.15 16.69,23.85 16.46,24.08 16.46,28.7 v15.65,29.52 | RN6.1 13.61,25.87 v13.57,25.6
  Bottom 0.254: v13.57,25.6 16.27,28.16 16.27,28.92 15.68,29.52 v15.65,29.52
PB0  (via drill 0.5)
  Top 0.254: U2.8 25.86,22.3 25.3,22.86 25.3,23.47 25.6,23.77 25.44,28.33 26.68,29.57 v28.04,29.57
  Bottom 0.254: SONIC.2 27.94,29.67 v28.04,29.57
PB4
  Top 0.254: U2.28 27.46,6.9 27.13,6.56 24.77,6.56 22.86,4.57 22.86,4.05 JP17.7
PB5
  Top 0.254: U2.29 28.26,6.62 27.51,5.95 25.07,5.95 24.03,4.79 24.04,2.72 JP17.8
PB6
  Top 0.254: U2.30 29.06,6.2 28.04,5.34 26.53,5.34 JP17.5
PB7  (via drill 0.5)
  Top 0.254: U2.12 21.66,19.63 22.77,20.57 22.77,22.1 22.78,22.59 22.86,25.89 23.69,26.88 25.08,28.97 25.48,29.48 v25.45,29.59 25.45,29.48
  Bottom 0.254: v25.45,29.59 25.45,29.81 25.4,30.48 SONIC.3
PC6
  Top 0.254: U2.31 29.86,9.46 29.87,9.45 29.87,5.98 JP17.3
PC7
  Top 0.254: U2.32 30.66,8.94 30.66,7.75 30.66,6.6 JP17.1
PD0  (via drill 0.5)
  Top 0.254: U2.18 23.04,14.76 v23.16,14.63
  Bottom 0.254: JP17.15 12.62,8.66 15.24,11.28 19.2,11.28 19.51,11.58 19.51,13.72 20.42,14.63 v23.16,14.63
PD1
  Top 0.254: JP17.13 15.16,4.19 15.24,4.88 16.46,6.1 17.68,6.1 18.29,6.71 18.29,7.62 19.51,8.84 19.51,13.41 20.05,13.96 U2.19
PD4
  Top 0.254: U2.25 25.06,8.76 24.69,8.39 22.7,8.39 20.1,5.79 19.52,5.79 JP17.11
PD6
  Top 0.254: U2.26 25.86,8.19 25.54,7.78 23.31,7.78 20.73,5.19 20.73,4.46 JP17.9
PD7
  Top 0.254: U2.27 26.66,7.46 26.37,7.17 23.92,7.17 21.51,4.76 21.51,2.7 JP17.10
PE6
  Top 0.254: U2.1 32.1,20.72 33.75,20.72 34.75,19.71 34.75,19.2 37.8,16.15 37.88,15.02 38.08,14.63 41.54,11.24 | R3.1 45.72,2.81 45.11,4.57 42.67,4.57 41.55,6 41.54,11.24 | 41.56,11.19 41.54,11.24
PF0  (via drill 0.5)
  Top 0.254: U2.41 27.42,17.16 25.15,14.88 25.15,14.12 v25.35,13.31
  Bottom 0.254: JP17.6 26.59,2.38 26.59,4.64 27.44,5.49 30.79,5.49 31.7,4.57 31.7,3.96 32.31,3.35 33.83,3.35 34.44,3.96 34.44,4.88 26.31,13.01 v25.35,13.31
PF1  (via drill 0.5)
  Top 0.254: v26.16,14.22 26.16,14.99 27.53,16.36 U2.40
  Bottom 0.254: JP17.4 29.13,2.54 28.83,2.26 29.29,2.7 34.38,2.7 35.05,3.35 35.05,5.18 34.14,6.25 v26.16,14.22 26.16,13.97
PF4  (via drill 0.5)
  Top 0.254: U2.39 34.99,15.56 35.62,15.53 v36.27,15.23 | IC3.12 35.47,37 35.36,36.88 35.36,32.92 36.58,31.7 v36.58,29.87
  Bottom 0.254: v36.27,15.23 36.27,14.94 36.58,15.24 36.58,16.46 35.97,17.07 35.97,24.38 36.58,24.99 v36.58,29.87
PF5  (via drill 0.5)
  Top 0.254: U2.38 34.47,14.76 v35.05,14.22 | v32.31,30.2 32.23,32.7 31.39,33.53 20.42,33.53 20.12,33.83 20.12,36.58 19.51,37.19 17.64,37.19 IC1.12
  Bottom 0.254: v35.05,14.22 34.04,15.24 34.04,28.15 v32.31,30.2
PF6  (via drill 0.5)
  Top 0.254: IC4.12 16.58,21.9 v16.19,21.51 | U2.37 32.37,13.96 32.31,14.02 31.6,14.58 v27.38,14.53
  Bottom 0.254: v27.38,14.53 27.23,14.53 24.69,17.07 20.63,17.07 v16.19,21.51
PF7  (via drill 0.5)
  Top 0.254: IC2.12 35.55,21.91 v35,21.68 | v35,17.17 35.92,17.12 37.19,15.85 37.19,14.63 35.71,13.16 U2.36
  Bottom 0.254: v35,17.17 v35,21.68
RST  (via drill 0.5)
  Top 0.254: U2.13 20.77,18.76 20.48,19.05 20.48,20.13 20.8,20.34 21.14,20.4 R4.1 22.05,21.43 22.15,22.3 22.15,26.51 21.67,26.99 21.5,26.99 v21.05,27.43 21.03,27.45 21.03,28.35 | SW1.2 19.99,29.39 21.03,28.35 | SW1.4 22.08,29.39 21.03,28.35
  Bottom 0.254: ISP1.5 v21.05,27.43
RX
  Top 0.254: U2.20 20.47,13.16 20.12,12.8 20.12,8.53 18.9,7.32 18.9,6.4 17.98,5.49 16.88,5.49 16.45,5.02 16.44,2.65 JP17.14
SCK  (via drill 0.5)  (4 unrouted)
  Top 0.254: IC3.11 36.43,37.62 35.19,37.62 34.75,37.19 34.75,31.8 v35.05,31.5 34.85,31.5 34.75,31.39 34.75,23.05 35.23,22.57 IC2.11 | 17.62,36.59 IC1.11 19.21,36.57 19.46,36.32 19.46,30.53 17.88,30.64 | 29.49,27.99 29.04,30.56 17.88,30.64 | IC4.11 18.51,21.25 18.9,21.64 18.9,21.95 20.12,23.16 20.12,24.38 19.51,24.99 18.9,24.99 17.68,26.21 17.68,30.2 17.88,30.64 | U2.9 25.06,20.19 v24.69,19.81
  Bottom 0.254: v35.05,31.5 32.26,31.5 30.48,29.72 29.97,29.72 29.46,29.21 ISP1.3 | 24.68,19.8 22.07,19.8 19.35,22.52
  other vias: 19.37,22.49
TX  (via drill 0.5)
  Top 0.254: U2.21 22.7,12.36 23.16,11.89 23.16,11.28 22.55,10.67 21.64,10.67 21.34,10.36 21.34,7.92 20.73,7.32 v20.2,7.32
  Bottom 0.254: JP17.12 17.7,1.59 18.97,2.94 18.97,6.17 v20.2,7.32
UCAP  (via drill 0.5)
  Top 0.254: U2.6 27.46,22.19 v26.49,23.16 | C1.1 21.08,23.11 v21.13,22.8
  Bottom 0.254: v21.13,22.8 22.55,21.34 25.3,21.34 26.21,22.86 v26.49,23.16
V_BATT
  Top 0.254: 23.97,41.22 U1.3
  Top 0.406: C7.1 19.34,42.52 21.32,42.52 C2.1 23.28,42.59 23.94,41.84 U1.3 | D2.P$1 28.56,39.01 26.39,41.18 U1.1 25.84,40.32 25.4,39.88 24.38,39.88 23.97,40.29 23.97,41.22
  Top 0.508: D3.P$1 D2.P$1
V_BATT_LOGIC  (via drill 0.5)
  Top 0.406: 32.54,41.72 D3.P$2 33.93,41.8 v34.8,42.67
  Bottom 0.406: EXT1.TIP 35.02,42.9 v34.8,42.67
V_BATT_PWR  (17 unrouted)
  Top 0.406: JP17.17 7.3,3.97 6.35,5.08
  Top 0.508: D2.P$2 28.56,43.85
  Top 1.93: 6.4,50.9 6.4,6.4 | 48.16,51.21 48.16,7.01
  pour Top (isolate 0.305): 54.93,58.1 55.56,51.28 44.08,51.12 42.12,48.22 38.39,43.66 24.77,43.58 16.99,43.58 13.49,47.07 10.95,48.9 9.76,51.1 -0.87,51.26 -0.71,58.5
  pour Top (isolate 0.305): 55.64,52.23 55.4,5.08 46.99,5.08 46.99,52.07 48.26,52.07
  pour Top (isolate 0.305): 7.54,50.72 7.62,5.08 -0.71,5.08 -0.87,53.34 9.21,52.7
V_USB
  Top 0.254: D1.P$2 11.54,6.45 F1.2
VBUS  (via drill 0.5)
  Top 0.254: U2.7 26.66,19.77 v26.67,19.76 | X1.VBUS 36.99,7.12 37.04,5.86 37.85,5.19 v37.92,3.11 37.86,3.05 36.27,3.05 35.05,4.27 33.22,4.27 v32.92,4.57 | F1.1 15.4,6.24 16.15,7.01 17.07,7.01 v17.37,7.24
  Bottom 0.254: v26.67,19.76 26.67,16.99 26.7,16.99 35.81,8.18 36.28,7.76 36.43,7.19 37.9,5.45 v37.92,3.11 | v17.37,7.24 18.36,8.3 29.19,8.3 v32.92,4.57
VCC  (via drill 0.5, 0.6)  (7 unrouted)
  Top 0.254: 24.29,18.03 24.29,11.51 33.34,11.51 | 24.29,10.05 U2.24 24.21,9.7 | 30.64,21.38 U2.2 30.66,19.93 | C5.1 22.33,38.41 | 33.3,19.53 U2.44 31.04,19.56 30.79,19.81 | 17.42,24.53 IC4.16 17.07,24.81 17.07,30.66 18.9,32.49 18.9,34.14 | C3.1 22.77,37.76 22.46,38.08 C5.1 | 36.49,38.26 IC3.10 34.64,38.3 34.14,37.8 34.14,36.58 33.83,36.27 31.09,36.27 | 20,21.3 R4.2 19.81,21.17 19.81,20.73 | 24.38,11.94 24.77,11.56 | 24.77,11.56 24.89,11.43 | 24.77,11.56 24.38,11.18 24.29,11.18 | 24.29,18.03 22.86,18.03 22.78,17.96 U2.14 20.14,17.96 19.81,18.29 19.81,20.73 | IC1.16 18.7,39.82 v18.9,39.62 21.95,39.62 22.56,39.62 C5.1 | IC1.10 18.55,35.92 18.9,35.66 18.9,34.14 | 31.09,36.27 26.82,36.27 26.2,36.9 25.3,36.9 | 31.09,36.27 31.09,34.75 v33.22,32.61 33.53,32.31 33.53,25.84 33.22,25.46 32.17,25.46 31.99,25.48 30.64,22.61 30.64,21.35 | IC3.16 36.45,32.74 v37.8,31.39 37.8,28.96 35.66,26.82 35.66,25.91 35.36,25.6 35.36,23.47 35.61,23.21 IC2.10 | 18.9,34.14 v17.98,34.14 | IC4.10 19.69,20.6 19.81,20.73 | 30.79,19.81 30.66,19.93 | 24.29,18.03 24.29,18.19 24.69,18.59 29.57,18.59 30.79,19.81 | 30.79,19.81 30.85,19.81 30.66,19.93 | IC2.16 36.45,18.72 37.19,17.98 37.8,17.98 | D1.P$1 14.77,8.67 14.33,8.48
  Top 0.305: C3.1 25.3,36.9 R5.1 25.84,37.22 U1.5
  Top 0.406: 24.29,10.05 24.29,11.18 24.29,11.51
  Bottom 0.254: 37.78,18.02 37.23,18.02 36.59,18.65 36.59,23.81 37.15,24.37 37.15,28.31 37.8,28.96 v37.8,31.39 36.58,32.61 v33.22,32.61 31.09,32.61 30.48,32 SONIC.1 | 15.51,8.19 16.76,9.45 20.73,9.45 22.86,11.58 v24.38,11.58 | v18.9,39.62 17.98,38.71 v17.98,34.14 | 15.51,8.19 15.51,6.46 13.89,4.84 13.89,3.1 13.49,2.67 11.3,2.67 JP17.18 | 15.51,8.19 14.62,8.19 14.33,8.48
  other vias: 14.33,8.53
XTAL1
  Top 0.254: C4.1 17.78,10.77 X2.P$2 17.78,13.21 20.13,15.56 U2.17
XTAL2  (1 unrouted)
  Top 0.254: C6.1 18.34,18.63 18.34,17.39 18.5,17.22 18.41,17.3
  Top 0.305: U2.16 20.08,16.36 19.45,16.99 18.04,16.99 X2.P$1

### Text on the board
tPlace: 4.8-7v | Servos | VCC | SIG | SIG | VCC | 0 | 31 | 5-10v | 1 | Logic | 30 | 2 | RN4 | 29 | 3 | 28 | IC3 | 4 | 27 | 5 | 26 | PWR | TRIG | 6 | ECHO | 25 | VCC | GND | 7 | 24 | RESET | 8 | 23 | 9 | ISP | 22 | 10 | 21 | 11 | 20 | 12 | 19 | 13 | 18 | 14 | 17 | 15 | 16 | GPIO | STATUS | 1 | 2 | USB
bPlace: BAT | SCL | SDA | 4/A6 | 12/A11 | 8/A8 | ~10/A10 | ~5 | 13 | VCC | GND | RX | TX | ~6/A7 | ~9/A9 | A5 | A4 | GND | Pin Map | Rev10